# Altium schematic sheet Front.SchDoc
size A3
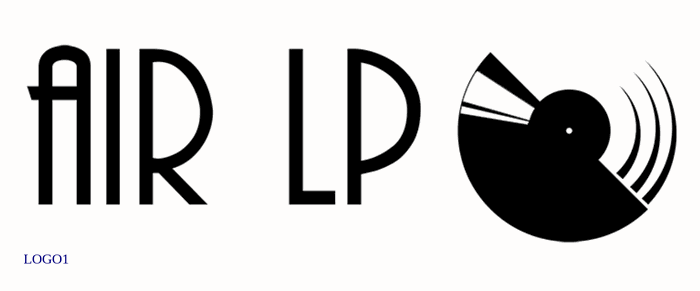
[diagram p0: Front.SchDoc]

## Parts
LOGO1  LOGO-AIRLP  [LOGO-AIR-LP]  (value not drawn)

## Library data of the parts
LOGO1 = LOGO-AIRLP: LOGO AIR LP